# Altium schematic sheet IOBoard.SchDoc
size A4
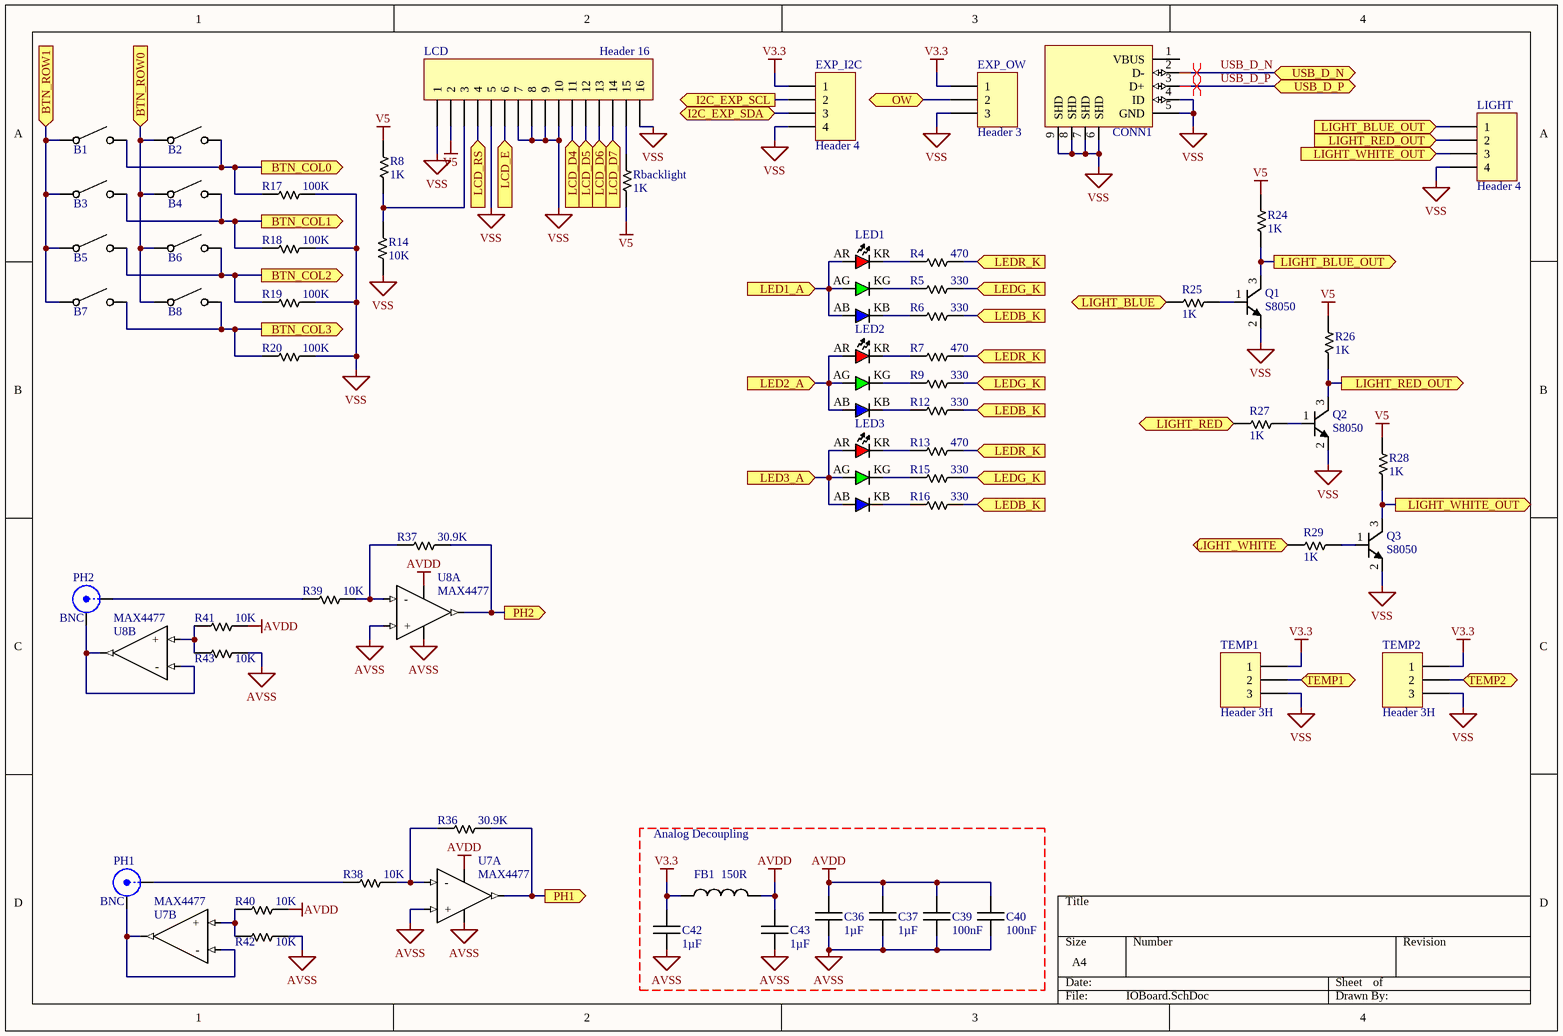
[diagram p0: IOBoard.SchDoc]

## Parts
B1  Tact Button NO  [Tact TH 4pin 6×6mm]  (value not drawn)
B2  Tact Button NO  [Tact TH 4pin 6×6mm]  (value not drawn)
B3  Tact Button NO  [Tact TH 4pin 6×6mm]  (value not drawn)
B4  Tact Button NO  [Tact TH 4pin 6×6mm]  (value not drawn)
B5  Tact Button NO  [Tact TH 4pin 6×6mm]  (value not drawn)
B6  Tact Button NO  [Tact TH 4pin 6×6mm]  (value not drawn)
B7  Tact Button NO  [Tact TH 4pin 6×6mm]  (value not drawn)
B8  Tact Button NO  [Tact TH 4pin 6×6mm]  (value not drawn)
C36  1µF  [CAPC1608N]
C37  1µF  [CAPC1608N]
C39  100nF  [CAPC1608N]
C40  100nF  [CAPC1608N]
C42  1µF  [CAPC1608N]
C43  1µF  [CAPC1608N]
CONN1  USB-Conn Mini-B SMD  [440478]  (value not drawn)
EXP_I2C  Header 4  [HDR1X4]
EXP_OW  Header 3  [HDR1X3]
FB1  150R  [INDC1608N]
LCD  Header 16  [HDR1X16]
LED1  LED RGB  [LED PLCC-6]  (value not drawn)
LED2  LED RGB  [LED PLCC-6]  (value not drawn)
LED3  LED RGB  [LED PLCC-6]  (value not drawn)
LIGHT  Header 4  [HDR1X4]
PH1  BNC  [BNC_RA CON]
PH2  BNC  [BNC_RA CON]
Q1  S8050  [SOT23]
Q2  S8050  [SOT23]
Q3  S8050  [SOT23]
R4  470  [RESC2012N]
R5  330  [RESC2012N]
R6  330  [RESC2012N]
R7  470  [RESC2012N]
R8  1K  [RESC1608N]
R9  330  [RESC2012N]
R12  330  [RESC2012N]
R13  470  [RESC2012N]
R14  10K  [RESC1608N]
R15  330  [RESC2012N]
R16  330  [RESC2012N]
R17  100K  [RESC1608N]
R18  100K  [RESC1608N]
R19  100K  [RESC1608N]
R20  100K  [RESC1608N]
R24  1K  [RESC1608N]
R25  1K  [RESC1608N]
R26  1K  [RESC1608N]
R27  1K  [RESC1608N]
R28  1K  [RESC1608N]
R29  1K  [RESC1608N]
R36  30.9K  [RESC1608N]
R37  30.9K  [RESC1608N]
R38  10K  [RESC1608N]
R39  10K  [RESC1608N]
R40  10K  [RESC1608N]
R41  10K  [RESC1608N]
R42  10K  [RESC1608N]
R43  10K  [RESC1608N]
Rbacklight  1K  [RESC1608N]
TEMP1  Header 3H  [HDR1X3H]
TEMP2  Header 3H  [HDR1X3H]
U7  MAX4477  [UMAX8_N]  (parts A,B of 2)
U8  MAX4477  [UMAX8_N]  (parts A,B of 2)

## Ports
BTN_COL0 (out), BTN_COL1 (out), BTN_COL2 (out), BTN_COL3 (out), BTN_ROW0 (in), BTN_ROW1 (in), I2C_EXP_SCL (out), I2C_EXP_SDA (bidir), LCD_D4 (in), LCD_D5 (in), LCD_D6 (in), LCD_D7 (in), LCD_E (in), LCD_RS (in), LED1_A (in), LED2_A (in), LED3_A (in), LEDB_K (in), LEDG_K (in), LEDR_K (in), LIGHT_BLUE (in), LIGHT_BLUE_OUT (in), LIGHT_BLUE_OUT (out), LIGHT_RED (in), LIGHT_RED_OUT (in), LIGHT_RED_OUT (out), LIGHT_WHITE (in), LIGHT_WHITE_OUT (in), LIGHT_WHITE_OUT (out), OW (bidir), PH1 (out), PH2 (out), TEMP1 (bidir), TEMP2 (bidir), USB_D_N (bidir), USB_D_P (bidir)

## Nets
AVDD: C36.2 C37.2 C39.2 C40.2 C43.2 FB1.2 R40.2 R41.2 U7.8(V+) U8.8(V+)
AVSS: C36.1 C37.1 C39.1 C40.1 C42.1 C43.1 R42.2 R43.2 U7.3(+) U7.4(V-) U8.3(+) U8.4(V-)
V3.3: C42.2 EXP_I2C.1 EXP_OW.1 FB1.1 TEMP1.1 TEMP2.1
V5: LCD.2 R8.2 R24.2 R26.2 R28.2 Rbacklight.1
VSS: CONN1.4(ID) CONN1.5(GND) CONN1.6(SHD) CONN1.7(SHD) CONN1.8(SHD) CONN1.9(SHD) EXP_I2C.4 EXP_OW.3 LCD.1 LCD.5 LCD.7 LCD.8 LCD.9 LCD.10 LCD.16 LIGHT.4 Q1.2(E) Q2.2(E) Q3.2(E) R14.2 R17.2 R18.2 R19.2 R20.2 TEMP1.3 TEMP2.3
BTN_COL0: B1.2 B2.2 R17.1 ; port BTN_COL0
BTN_COL1: B3.2 B4.2 R18.1 ; port BTN_COL1
BTN_COL2: B5.2 B6.2 R19.1 ; port BTN_COL2
BTN_COL3: B7.2 B8.2 R20.1 ; port BTN_COL3
BTN_ROW0: B2.1 B4.1 B6.1 B8.1 ; port BTN_ROW0
BTN_ROW1: B1.1 B3.1 B5.1 B7.1 ; port BTN_ROW1
I2C_EXP_SCL: EXP_I2C.2 ; port I2C_EXP_SCL
I2C_EXP_SDA: EXP_I2C.3 ; port I2C_EXP_SDA
LCD_D4: LCD.11 ; port LCD_D4
LCD_D5: LCD.12 ; port LCD_D5
LCD_D6: LCD.13 ; port LCD_D6
LCD_D7: LCD.14 ; port LCD_D7
LCD_E: LCD.6 ; port LCD_E
LCD_RS: LCD.4 ; port LCD_RS
LED1_A: LED1.AB LED1.AG LED1.AR ; port LED1_A
LED2_A: LED2.AB LED2.AG LED2.AR ; port LED2_A
LED3_A: LED3.AB LED3.AG LED3.AR ; port LED3_A
LEDB_K: R6.2 R12.2 R16.2 ; port LEDB_K
LEDG_K: R5.2 R9.2 R15.2 ; port LEDG_K
LEDR_K: R4.2 R7.2 R13.2 ; port LEDR_K
LIGHT_BLUE: R25.1 ; port LIGHT_BLUE
LIGHT_BLUE_OUT: LIGHT.1 Q1.3(C) R24.1 ; port LIGHT_BLUE_OUT
LIGHT_RED: R27.1 ; port LIGHT_RED
LIGHT_RED_OUT: LIGHT.2 Q2.3(C) R26.1 ; port LIGHT_RED_OUT
LIGHT_WHITE: R29.1 ; port LIGHT_WHITE
LIGHT_WHITE_OUT: LIGHT.3 Q3.3(C) R28.1 ; port LIGHT_WHITE_OUT
OW: EXP_OW.2 ; port OW
PH1: R36.2 U7.1(O) ; port PH1
PH2: R37.2 U8.1(O) ; port PH2
TEMP1: TEMP1.2 ; port TEMP1
TEMP2: TEMP2.2 ; port TEMP2
USB_D_N: CONN1.2(D-) ; port USB_D_N
USB_D_P: CONN1.3(D+) ; port USB_D_P
NetLCD_3: LCD.3 R8.1 R14.1
NetLCD_15: LCD.15 Rbacklight.2
NetLED1_KB: LED1.KB R6.1
NetLED1_KG: LED1.KG R5.1
NetLED1_KR: LED1.KR R4.1
NetLED2_KB: LED2.KB R12.1
NetLED2_KG: LED2.KG R9.1
NetLED2_KR: LED2.KR R7.1
NetLED3_KB: LED3.KB R16.1
NetLED3_KG: LED3.KG R15.1
NetLED3_KR: LED3.KR R13.1
NetPH1_1: PH1.1(X) R38.1
NetPH1_2: PH1.2(Y) U7.6(-) U7.7(O)
NetPH2_1: PH2.1(X) R39.1
NetPH2_2: PH2.2(Y) U8.6(-) U8.7(O)
NetQ1_1: Q1.1(B) R25.2
NetQ2_1: Q2.1(B) R27.2
NetQ3_1: Q3.1(B) R29.2
NetR36_1: R36.1 R38.2 U7.2(-)
NetR37_1: R37.1 R39.2 U8.2(-)
NetR40_1: R40.1 R42.1 U7.5(+)
NetR41_1: R41.1 R43.1 U8.5(+)

Not connected (* = marked no-connect by the designer): CONN1 1(VBUS)

## Layout directives
differential pair: USB_D_N, USB_D_P

## Notes on the sheet
- Analog Decoupling

## Library data of the parts
B1-B8 = Tact Button NO: pin to pad: 1>1+3 2>2+4
C36 C37 C39 C40 C42 C43 = Capacitor
  C36 C37 C42 C43: Value: 1µF
  C39 C40: Value: 100nF
EXP_I2C LIGHT = Header 4: Header, 4-Pin; LatestRevisionDate: 17-Jul-2002; LatestRevisionNote: Re-released for DXP Platform.; Publisher: Altium Limited
EXP_OW = Header 3: Header, 3-Pin; LatestRevisionDate: 17-Jul-2002; LatestRevisionNote: Re-released for DXP Platform.; Publisher: Altium Limited
FB1 = Inductor: Value: 150R
LCD = Header 16: Header, 16-Pin; LatestRevisionDate: 17-Jul-2002; LatestRevisionNote: Re-released for DXP Platform.; Publisher: Altium Limited
LED1-LED3 = LED RGB: pin to pad: AB>6 AG>2 AR>4 KB>5 KG>1 KR>3
PH1 PH2 = BNC: BNC Elbow Connector; LatestRevisionDate: 17-Jul-2002; LatestRevisionNote: Re-released for DXP Platform.; Publisher: Altium Limited
Q1-Q3 = NPN: Model: S8050
R4-R9 R12-R20 R24-R29 R36-R43 Rbacklight = Resistor
  R4 R7 R13: Value: 470
  R5 R6 R9 R12 R15 R16: Value: 330
  R8 R24-R29 Rbacklight: Value: 1K
  R14 R38-R43: Value: 10K
  R17-R20: Value: 100K
  R36 R37: Value: 30.9K
TEMP1 TEMP2 = Header 3H: Header, 3-Pin, Right Angle; LatestRevisionDate: 17-Jul-2002; LatestRevisionNote: Re-released for DXP Platform.; Publisher: Altium Limited
U7 U8 = Opamp dual: Model: MAX4477